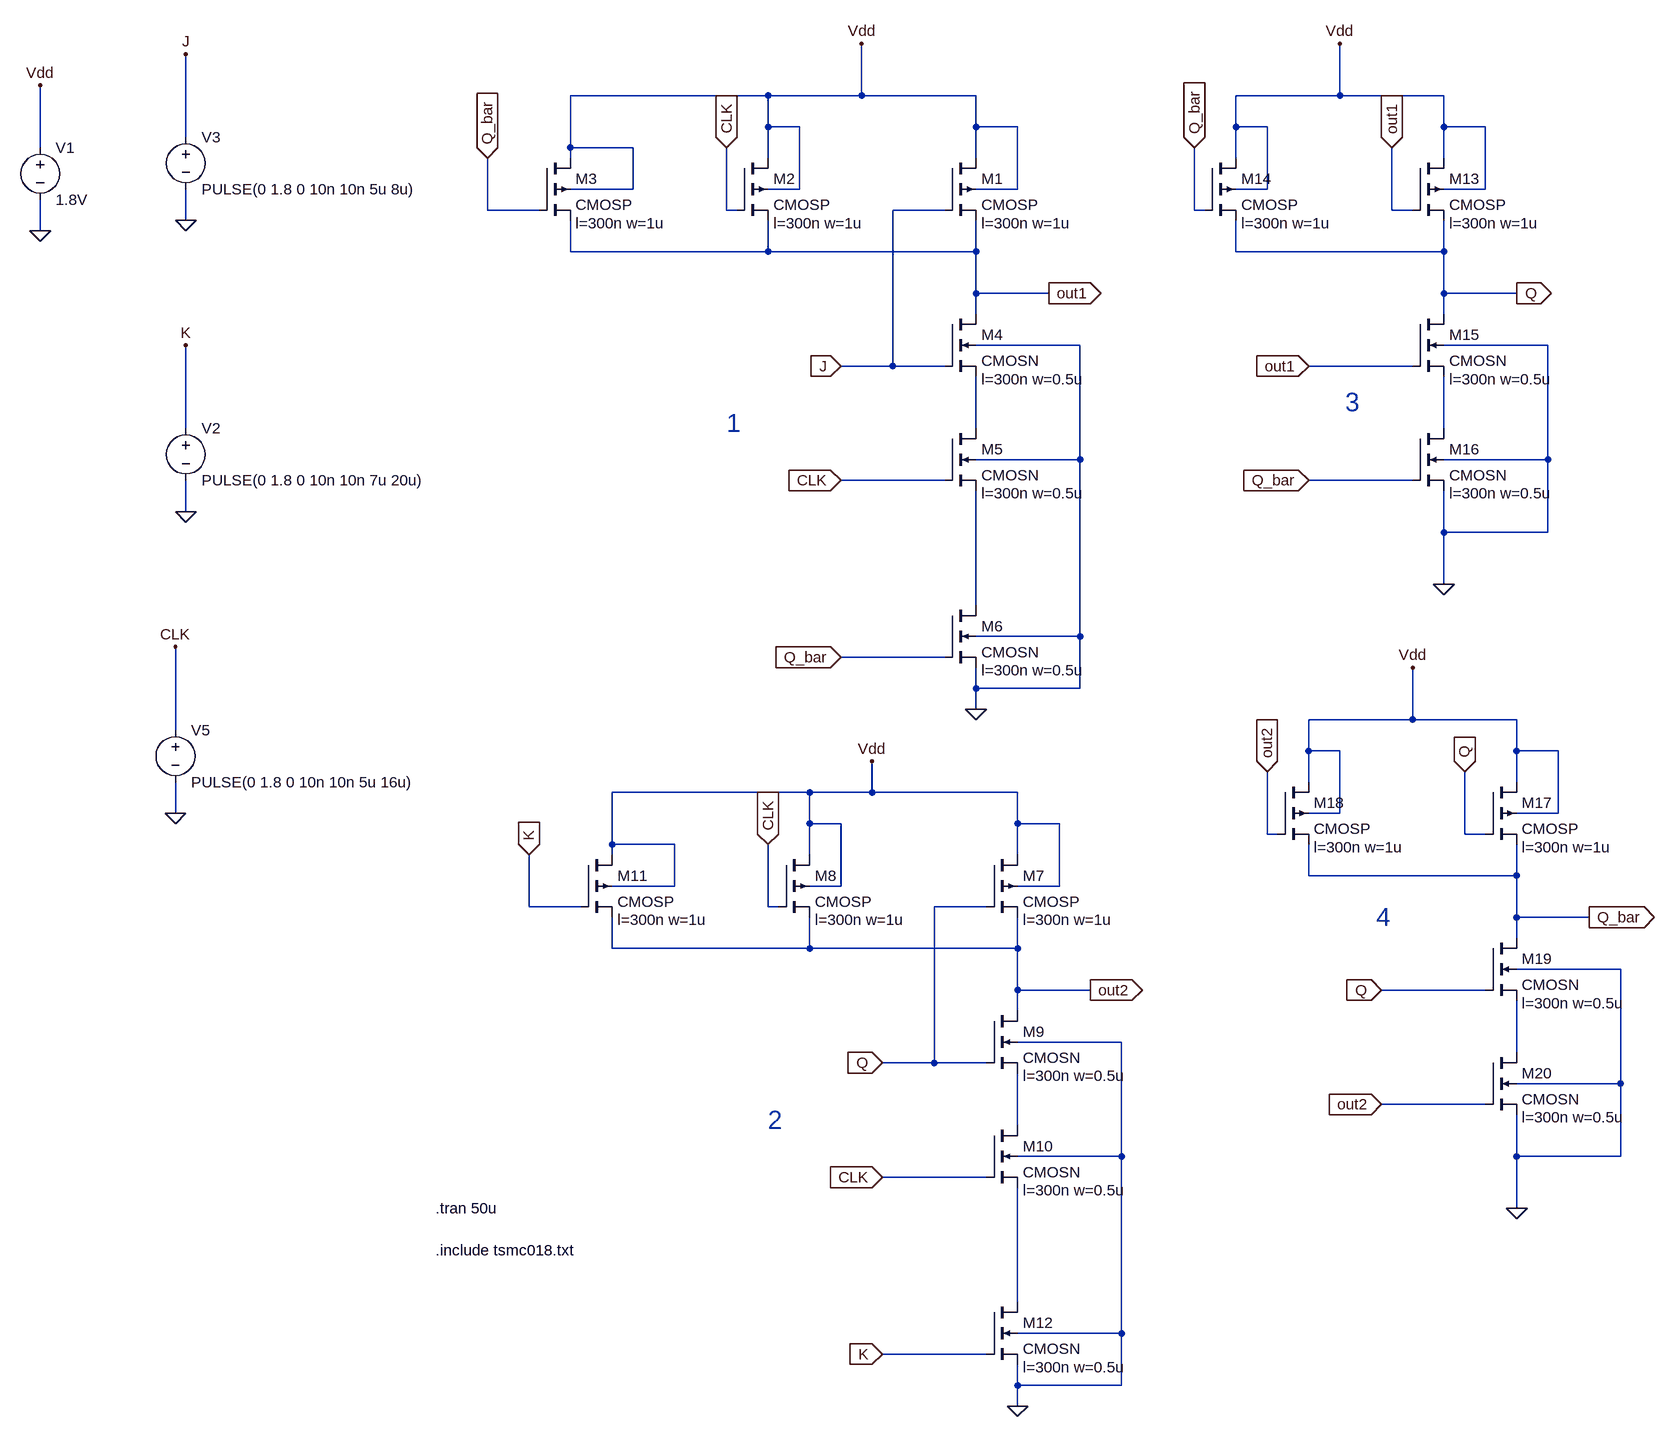
[diagram p0: schematic JK_FF.asc]
JK_FF.asc, the LTspice schematic file:
Version 4
SHEET 1 1488 2276
WIRE -144 -16 -448 -16
WIRE 0 -16 0 -96
WIRE 0 -16 -144 -16
WIRE 176 -16 0 -16
WIRE 736 -16 736 -96
WIRE 736 -16 576 -16
WIRE 896 -16 736 -16
WIRE -144 32 -144 -16
WIRE -96 32 -144 32
WIRE 176 32 176 -16
WIRE 240 32 176 32
WIRE 576 32 576 -16
WIRE 624 32 576 32
WIRE 896 32 896 -16
WIRE 960 32 896 32
WIRE -1040 48 -1040 -80
WIRE -1264 64 -1264 -32
WIRE -448 64 -448 -16
WIRE -352 64 -448 64
WIRE -448 80 -448 64
WIRE -144 80 -144 32
WIRE 176 80 176 32
WIRE 576 80 576 32
WIRE 896 80 896 32
WIRE -352 128 -352 64
WIRE -352 128 -448 128
WIRE -96 128 -96 32
WIRE -96 128 -144 128
WIRE 240 128 240 32
WIRE 240 128 176 128
WIRE 624 128 624 32
WIRE 624 128 576 128
WIRE 960 128 960 32
WIRE 960 128 896 128
WIRE -576 160 -576 80
WIRE -496 160 -576 160
WIRE -208 160 -208 64
WIRE -192 160 -208 160
WIRE 128 160 48 160
WIRE 512 160 512 64
WIRE 528 160 512 160
WIRE 816 160 816 64
WIRE 848 160 816 160
WIRE -1040 176 -1040 128
WIRE -1264 192 -1264 144
WIRE -448 224 -448 176
WIRE -144 224 -144 176
WIRE -144 224 -448 224
WIRE 176 224 176 176
WIRE 176 224 -144 224
WIRE 576 224 576 176
WIRE 896 224 896 176
WIRE 896 224 576 224
WIRE 176 288 176 224
WIRE 288 288 176 288
WIRE 896 288 896 224
WIRE 1008 288 896 288
WIRE 176 320 176 288
WIRE 896 320 896 288
WIRE 336 368 176 368
WIRE 1056 368 896 368
WIRE 48 400 48 160
WIRE 48 400 -32 400
WIRE 128 400 48 400
WIRE 848 400 688 400
WIRE -1040 496 -1040 368
WIRE 176 496 176 416
WIRE 896 496 896 416
WIRE 336 544 336 368
WIRE 336 544 176 544
WIRE 1056 544 1056 368
WIRE 1056 544 896 544
WIRE 128 576 -32 576
WIRE 848 576 688 576
WIRE -1040 624 -1040 576
WIRE 896 656 896 592
WIRE 1056 656 1056 544
WIRE 1056 656 896 656
WIRE 896 736 896 656
WIRE 176 768 176 592
WIRE 336 816 336 544
WIRE 336 816 176 816
WIRE 128 848 -32 848
WIRE 176 896 176 864
WIRE 336 896 336 816
WIRE 336 896 176 896
WIRE 176 928 176 896
WIRE 848 944 848 864
WIRE 848 944 688 944
WIRE 1008 944 848 944
WIRE -1056 960 -1056 832
WIRE 688 992 688 944
WIRE 736 992 688 992
WIRE 1008 992 1008 944
WIRE 1072 992 1008 992
WIRE 688 1040 688 992
WIRE 1008 1040 1008 992
WIRE -80 1056 -384 1056
WIRE 16 1056 16 1008
WIRE 16 1056 -80 1056
WIRE 240 1056 16 1056
WIRE -1056 1088 -1056 1040
WIRE 736 1088 736 992
WIRE 736 1088 688 1088
WIRE 1072 1088 1072 992
WIRE 1072 1088 1008 1088
WIRE -80 1104 -80 1056
WIRE -32 1104 -80 1104
WIRE 240 1104 240 1056
WIRE 304 1104 240 1104
WIRE 624 1120 624 1024
WIRE 640 1120 624 1120
WIRE 928 1120 928 1024
WIRE 960 1120 928 1120
WIRE -384 1136 -384 1056
WIRE -288 1136 -384 1136
WIRE -384 1152 -384 1136
WIRE -80 1152 -80 1104
WIRE 240 1152 240 1104
WIRE 688 1184 688 1136
WIRE 1008 1184 1008 1136
WIRE 1008 1184 688 1184
WIRE -288 1200 -288 1136
WIRE -288 1200 -384 1200
WIRE -32 1200 -32 1104
WIRE -32 1200 -80 1200
WIRE 304 1200 304 1104
WIRE 304 1200 240 1200
WIRE -512 1232 -512 1152
WIRE -432 1232 -512 1232
WIRE -144 1232 -144 1136
WIRE -128 1232 -144 1232
WIRE 192 1232 112 1232
WIRE 1008 1248 1008 1184
WIRE 1120 1248 1008 1248
WIRE 1008 1280 1008 1248
WIRE -384 1296 -384 1248
WIRE -80 1296 -80 1248
WIRE -80 1296 -384 1296
WIRE 240 1296 240 1248
WIRE 240 1296 -80 1296
WIRE 1168 1328 1008 1328
WIRE 240 1360 240 1296
WIRE 352 1360 240 1360
WIRE 960 1360 800 1360
WIRE 240 1392 240 1360
WIRE 400 1440 240 1440
WIRE 1008 1456 1008 1376
WIRE 112 1472 112 1232
WIRE 112 1472 32 1472
WIRE 192 1472 112 1472
WIRE 1168 1504 1168 1328
WIRE 1168 1504 1008 1504
WIRE 960 1536 800 1536
WIRE 240 1568 240 1488
WIRE 400 1616 400 1440
WIRE 400 1616 240 1616
WIRE 1008 1616 1008 1552
WIRE 1168 1616 1168 1504
WIRE 1168 1616 1008 1616
WIRE 192 1648 32 1648
WIRE 1008 1696 1008 1616
WIRE 240 1840 240 1664
WIRE 400 1888 400 1616
WIRE 400 1888 240 1888
WIRE 192 1920 32 1920
WIRE 240 1968 240 1936
WIRE 400 1968 400 1888
WIRE 400 1968 240 1968
WIRE 240 2000 240 1968
FLAG -32 400 J
IOPIN -32 400 In
FLAG -208 64 CLK
IOPIN -208 64 In
FLAG -32 576 CLK
IOPIN -32 576 In
FLAG 288 288 out1
IOPIN 288 288 Out
FLAG -1264 192 0
FLAG -1040 624 0
FLAG -1040 368 K
FLAG -1040 176 0
FLAG -1040 -80 J
FLAG 176 928 0
FLAG -32 848 Q_bar
IOPIN -32 848 In
FLAG -576 80 Q_bar
IOPIN -576 80 In
FLAG -1056 1088 0
FLAG -1056 832 CLK
FLAG -1264 -32 Vdd
FLAG 32 1472 Q
IOPIN 32 1472 In
FLAG -144 1136 CLK
IOPIN -144 1136 In
FLAG 32 1648 CLK
IOPIN 32 1648 In
FLAG 352 1360 out2
IOPIN 352 1360 Out
FLAG 240 2000 0
FLAG 32 1920 K
IOPIN 32 1920 In
FLAG -512 1152 K
IOPIN -512 1152 In
FLAG 16 1008 Vdd
FLAG 816 64 out1
IOPIN 816 64 In
FLAG 688 400 out1
IOPIN 688 400 In
FLAG 512 64 Q_bar
IOPIN 512 64 In
FLAG 688 576 Q_bar
IOPIN 688 576 In
FLAG 1008 288 Q
IOPIN 1008 288 Out
FLAG 896 736 0
FLAG 736 -96 Vdd
FLAG 928 1024 Q
IOPIN 928 1024 In
FLAG 800 1360 Q
IOPIN 800 1360 In
FLAG 624 1024 out2
IOPIN 624 1024 In
FLAG 800 1536 out2
IOPIN 800 1536 In
FLAG 1120 1248 Q_bar
IOPIN 1120 1248 Out
FLAG 1008 1696 0
FLAG 848 864 Vdd
FLAG 0 -96 Vdd
SYMBOL pmos4 128 80 R0
WINDOW 123 56 100 Left 2
SYMATTR Value2 l=300n w=1u
SYMATTR InstName M1
SYMATTR Value CMOSP
SYMBOL pmos4 -192 80 R0
WINDOW 123 56 100 Left 2
SYMATTR Value2 l=300n w=1u
SYMATTR InstName M2
SYMATTR Value CMOSP
SYMBOL nmos4 128 320 R0
WINDOW 123 56 100 Left 2
SYMATTR Value2 l=300n w=0.5u
SYMATTR InstName M4
SYMATTR Value CMOSN
SYMBOL nmos4 128 496 R0
WINDOW 123 56 100 Left 2
SYMATTR Value2 l=300n w=0.5u
SYMATTR InstName M5
SYMATTR Value CMOSN
SYMBOL voltage -1264 48 R0
WINDOW 123 0 0 Left 0
WINDOW 39 0 0 Left 0
SYMATTR InstName V1
SYMATTR Value 1.8V
SYMBOL voltage -1040 480 R0
WINDOW 123 0 0 Left 0
WINDOW 39 0 0 Left 0
SYMATTR InstName V2
SYMATTR Value PULSE(0 1.8 0 10n 10n 7u 20u)
SYMBOL voltage -1040 32 R0
WINDOW 123 0 0 Left 0
WINDOW 39 0 0 Left 0
SYMATTR InstName V3
SYMATTR Value PULSE(0 1.8 0 10n 10n 5u 8u)
SYMBOL pmos4 -496 80 R0
WINDOW 123 56 100 Left 2
SYMATTR Value2 l=300n w=1u
SYMATTR InstName M3
SYMATTR Value CMOSP
SYMBOL nmos4 128 768 R0
WINDOW 123 56 100 Left 2
SYMATTR Value2 l=300n w=0.5u
SYMATTR InstName M6
SYMATTR Value CMOSN
SYMBOL voltage -1056 944 R0
WINDOW 123 0 0 Left 0
WINDOW 39 0 0 Left 0
SYMATTR InstName V5
SYMATTR Value PULSE(0 1.8 0 10n 10n 5u 16u)
SYMBOL pmos4 192 1152 R0
WINDOW 123 56 100 Left 2
SYMATTR Value2 l=300n w=1u
SYMATTR InstName M7
SYMATTR Value CMOSP
SYMBOL pmos4 -128 1152 R0
WINDOW 123 56 100 Left 2
SYMATTR Value2 l=300n w=1u
SYMATTR InstName M8
SYMATTR Value CMOSP
SYMBOL nmos4 192 1392 R0
WINDOW 123 56 100 Left 2
SYMATTR Value2 l=300n w=0.5u
SYMATTR InstName M9
SYMATTR Value CMOSN
SYMBOL nmos4 192 1568 R0
WINDOW 123 56 100 Left 2
SYMATTR Value2 l=300n w=0.5u
SYMATTR InstName M10
SYMATTR Value CMOSN
SYMBOL pmos4 -432 1152 R0
WINDOW 123 56 100 Left 2
SYMATTR Value2 l=300n w=1u
SYMATTR InstName M11
SYMATTR Value CMOSP
SYMBOL nmos4 192 1840 R0
WINDOW 123 56 100 Left 2
SYMATTR Value2 l=300n w=0.5u
SYMATTR InstName M12
SYMATTR Value CMOSN
SYMBOL pmos4 848 80 R0
WINDOW 123 56 100 Left 2
SYMATTR Value2 l=300n w=1u
SYMATTR InstName M13
SYMATTR Value CMOSP
SYMBOL pmos4 528 80 R0
WINDOW 123 56 100 Left 2
SYMATTR Value2 l=300n w=1u
SYMATTR InstName M14
SYMATTR Value CMOSP
SYMBOL nmos4 848 320 R0
WINDOW 123 56 100 Left 2
SYMATTR Value2 l=300n w=0.5u
SYMATTR InstName M15
SYMATTR Value CMOSN
SYMBOL nmos4 848 496 R0
WINDOW 123 56 100 Left 2
SYMATTR Value2 l=300n w=0.5u
SYMATTR InstName M16
SYMATTR Value CMOSN
SYMBOL pmos4 960 1040 R0
WINDOW 123 56 100 Left 2
SYMATTR Value2 l=300n w=1u
SYMATTR InstName M17
SYMATTR Value CMOSP
SYMBOL pmos4 640 1040 R0
WINDOW 123 56 100 Left 2
SYMATTR Value2 l=300n w=1u
SYMATTR InstName M18
SYMATTR Value CMOSP
SYMBOL nmos4 960 1280 R0
WINDOW 123 56 100 Left 2
SYMATTR Value2 l=300n w=0.5u
SYMATTR InstName M19
SYMATTR Value CMOSN
SYMBOL nmos4 960 1456 R0
WINDOW 123 56 100 Left 2
SYMATTR Value2 l=300n w=0.5u
SYMATTR InstName M20
SYMATTR Value CMOSN
TEXT -656 1760 Left 2 !.include tsmc018.txt
TEXT -656 1696 Left 2 !.tran 50u
TEXT -208 488 Left 4 ;1
TEXT -144 1560 Left 4 ;2
TEXT 744 456 Left 4 ;3
TEXT 792 1248 Left 4 ;4

The netlist it stands for:
* JK_FF.asc
M1 Vdd J out1 Vdd CMOSP l=300n w=1u
M2 Vdd CLK out1 Vdd CMOSP l=300n w=1u
M4 out1 J N001 0 CMOSN l=300n w=0.5u
M5 N001 CLK N003 0 CMOSN l=300n w=0.5u
V1 Vdd 0 1.8V
V2 K 0 PULSE(0 1.8 0 10n 10n 7u 20u)
V3 J 0 PULSE(0 1.8 0 10n 10n 5u 8u)
M3 Vdd Q_bar out1 Vdd CMOSP l=300n w=1u
M6 N003 Q_bar 0 0 CMOSN l=300n w=0.5u
V5 CLK 0 PULSE(0 1.8 0 10n 10n 5u 16u)
M7 Vdd Q out2 Vdd CMOSP l=300n w=1u
M8 Vdd CLK out2 Vdd CMOSP l=300n w=1u
M9 out2 Q N005 0 CMOSN l=300n w=0.5u
M10 N005 CLK N006 0 CMOSN l=300n w=0.5u
M11 Vdd K out2 Vdd CMOSP l=300n w=1u
M12 N006 K 0 0 CMOSN l=300n w=0.5u
M13 Vdd out1 Q Vdd CMOSP l=300n w=1u
M14 Vdd Q_bar Q Vdd CMOSP l=300n w=1u
M15 Q out1 N002 0 CMOSN l=300n w=0.5u
M16 N002 Q_bar 0 0 CMOSN l=300n w=0.5u
M17 Vdd Q Q_bar Vdd CMOSP l=300n w=1u
M18 Vdd out2 Q_bar Vdd CMOSP l=300n w=1u
M19 Q_bar Q N004 0 CMOSN l=300n w=0.5u
M20 N004 out2 0 0 CMOSN l=300n w=0.5u
.model NMOS NMOS
.model PMOS PMOS
.lib standard.mos
.include tsmc018.txt
.tran 50u
* 1
* 2
* 3
* 4
.backanno
.end